# EAGLE design devBoard (EAGLE 7.2.0)
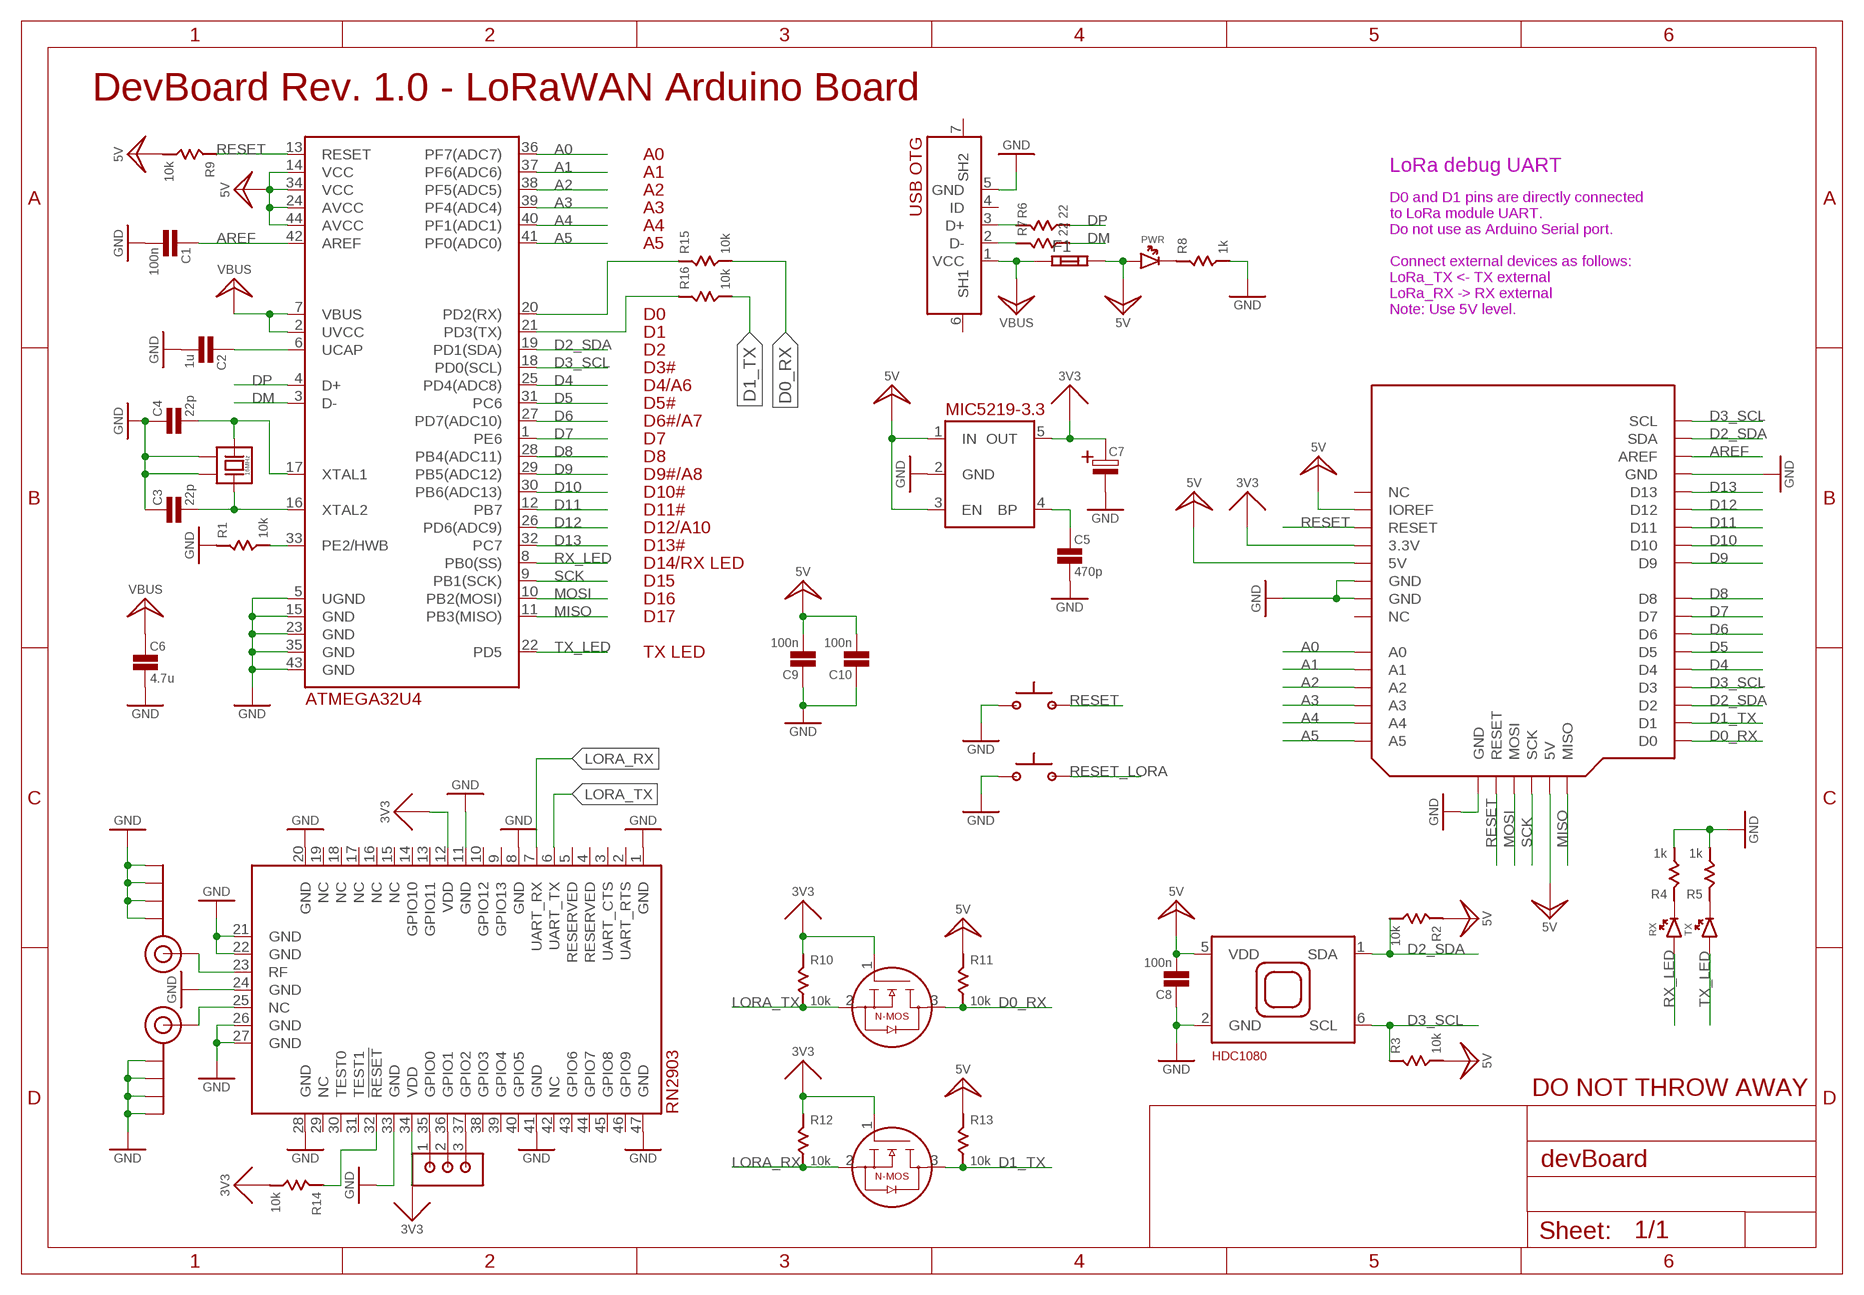
[diagram p0: schematic, sheet 1]

## Parts
C1  100n  C0603  [0603]
C2  1u  C0603  [0603]
C3  22p  C0603  [0603]
C4  22p  C0603  [0603]
C5  470p  C0603  [0603]
C6  4.7u  C0603  [0603]
C7  CT3216  [CT3216]
C8  100n  C0603  [0603]
C9  100n  C0603  [0603]
C10  100n  C0603  [0603]
F1  MF-MSMF050  [MF-MSMF050]
J$1  SMA_EDGE  [SMA-EDGE]
J$2  SMA_EDGE  [SMA-EDGE]
PWR  PWR  0603LED  [0603LED]
R1  10k  R0603  [0603]
R2  10k  R0603  [0603]
R3  10k  R0603  [0603]
R4  1k  R0603  [0603]
R5  1k  R0603  [0603]
R6  22  R0603  [0603]
R7  22  R0603  [0603]
R8  1k  R0603  [0603]
R9  10k  R0603  [0603]
R10  10k  R0603  [0603]
R11  10k  R0603  [0603]
R12  10k  R0603  [0603]
R13  10k  R0603  [0603]
R14  10k  R0603  [0603]
R15  10k  R0603  [0603]
R16  10k  R0603  [0603]
RX  RX  0603LED  [0603LED]
SW2  PUSH_BTN  [PUSH_BTN]
SW3  PUSH_BTN  [PUSH_BTN]
T1  BSS138  [SOT23-3]
T2  BSS138  [SOT23-3]
TX  TX  0603LED  [0603LED]
U1  RN2903  [RN2903]
U$1  ATMEGA32U4-MU  [QFN44]
U$2  ARDUINO_UNO  [ARDUINO_UNO]
U$9  HDC1080  [HDC1080]
U$34  MIC5219-3.3  [SOT-23-5]
U$45  USB_OTG  [USB_OTG]
U$59  1X3_HEADER  [1X3_HEADER]
U$65  DONT_THROW  [DONT_THROW]
Y1  16MHz  CX3225SB12000H0PSTC1  [XTAL3225]

## Nets
3V3: C7.AN R10.1 R12.1 R14.2 T1.1(G) T2.1(G) U1.12(VDD) U1.34(VDD) U$2.3.3V U$34.5(OUT)
5V: C8.2 C9.2 C10.2 F1.2 PWR.AN R2.1 R3.2 R9.2 R11.1 R13.1 U$1.14(VCC) U$1.24(AVCC) U$1.34(VCC) U$1.44(AVCC) U$2.5V U$2.ICSP_2(5V) U$2.IOREF U$9.5(VDD) U$34.1(IN) U$34.3(EN)
A0: U$1.36(PF7(ADC7)) U$2.A0
A1: U$1.37(PF6(ADC6)) U$2.A1
A2: U$1.38(PF5(ADC5)) U$2.A2
A3: U$1.39(PF4(ADC4)) U$2.A3
A4: U$1.40(PF1(ADC1)) U$2.A4
A5: U$1.41(PF0(ADC0)) U$2.A5
AREF: C1.1 U$1.42(AREF) U$2.AREF
D0_RX: R11.2 R15.2 T1.3(D) U$2.D0
D1_TX: R13.2 R16.2 T2.3(D) U$2.D1
D2_SDA: R2.2 U$1.19(PD1(SDA)) U$2.D2 U$2.SDA U$9.1(SDA)
D3_SCL: R3.1 U$1.18(PD0(SCL)) U$2.D3 U$2.SCL U$9.6(SCL)
D4: U$1.25(PD4(ADC8)) U$2.D4
D5: U$1.31(PC6) U$2.D5
D6: U$1.27(PD7(ADC10)) U$2.D6
D7: U$1.1(PE6) U$2.D7
D8: U$1.28(PB4(ADC11)) U$2.D8
D9: U$1.29(PB5(ADC12)) U$2.D9
D10: U$1.30(PB6(ADC13)) U$2.D10
D11: U$1.12(PB7) U$2.D11
D12: U$1.26(PD6(ADC9)) U$2.D12
D13: U$1.32(PC7) U$2.D13
DM: R7.2 U$1.3(D-)
DP: R6.2 U$1.4(D+)
GND: C1.2 C2.2 C3.1 C4.1 C5.2 C6.2 C7.CAT C8.1 C9.1 C10.1 J$1.GND@0(GND) J$1.GND@1(GND) J$1.GND@2(GND) J$1.GND@3(GND) J$2.GND@0(GND) J$2.GND@1(GND) J$2.GND@2(GND) J$2.GND@3(GND) R1.1 R4.2 R5.2 R8.2 SW2.1 SW3.1 U1.1(GND) U1.8(GND) U1.11(GND) U1.20(GND) U1.21(GND) U1.22(GND) U1.24(GND) U1.26(GND) U1.27(GND) U1.28(GND) U1.33(GND) U1.41(GND) U1.47(GND) U$1.5(UGND) U$1.15(GND) U$1.23(GND) U$1.35(GND) U$1.43(GND) U$2.GND@2(GND) U$2.GND@3(GND) U$2.GND@4(GND) U$2.ICSP_6(GND) U$9.2(GND) U$34.2(GND) U$45.5(GND) Y1.2 Y1.4
LORA_RX: R12.2 T2.2(S) U1.7(UART_RX)
LORA_TX: R10.2 T1.2(S) U1.6(UART_TX)
MISO: U$1.11(PB3(MISO)) U$2.ICSP_1(MISO)
MOSI: U$1.10(PB2(MOSI)) U$2.ICSP_4(MOSI)
N$1: R1.2 U$1.33(PE2/HWB)
N$2: C2.1 U$1.6(UCAP)
N$3: J$1.SIG(SIGNAL) U1.23(RF)
N$6: J$2.SIG(SIGNAL) U1.25(NC)
N$7: C3.2 U$1.16(XTAL2) Y1.1
N$8: C4.2 U$1.17(XTAL1) Y1.3
N$9: C5.1 U$34.4(BP)
N$10: R4.1 RX.CA
N$11: R5.1 TX.CA
N$12: R6.1 U$45.3(D+)
N$13: R7.1 U$45.2(D-)
N$14: PWR.CA R8.1
N$15: U1.37(GPIO2) U$59.3
N$16: U1.36(GPIO1) U$59.2
N$17: U1.35(GPIO0) U$59.1
N$18: R15.1 U$1.20(PD2(RX))
N$19: R16.1 U$1.21(PD3(TX))
RESET: R9.1 SW2.2 U$1.13(RESET) U$2.ICSP_5(RESET) U$2.RESET
RESET_LORA: R14.1 SW3.2 U1.32(!RESET)
RX_LED: RX.AN U$1.8(PB0(SS))
SCK: U$1.9(PB1(SCK)) U$2.ICSP_3(SCK)
TX_LED: TX.AN U$1.22(PD5)
VBUS: C6.1 F1.1 U$1.2(UVCC) U$1.7(VBUS) U$45.1(VCC)
Unconnected: U1.2(UART_RTS) U1.3(UART_CTS) U1.4(RESERVED) U1.5(RESERVED) U1.9(GPIO13) U1.10(GPIO12) U1.13(GPIO11) U1.14(GPIO10) U1.15(NC) U1.16(NC) U1.17(NC) U1.18(NC) U1.19(NC) U1.29(NC) U1.30(TEST0) U1.31(TEST1) U1.38(GPIO3) U1.39(GPIO4) U1.40(GPIO5) U1.42(NC) U1.43(GPIO6) U1.44(GPIO7) U1.45(GPIO8) U1.46(GPIO9) U$2.NC@1(NC) U$2.NC@2(NC) U$45.4(ID) U$45.6(SH1) U$45.7(SH2)

## Notes on the sheet
- DevBoard Rev. 1.0 - LoRaWAN Arduino Board
- LoRa debug UART
- D0 and D1 pins are directly connected
  to LoRa module UART.
  Do not use as Arduino Serial port.
  
  Connect external devices as follows:
  LoRa_TX <- TX external
  LoRa_RX -> RX external
  Note: Use 5V level.

## Library data of the parts
C1-C6 C8-C10 = reach:C0603
C7 = veloTrack:CT3216
F1 = reach:MF-MSMF050
J$1 J$2 = SparkFun-Connectors:SMA_EDGE: SMA Antenna Connector End launch SMA connector. The paste layer has been removed so that the connector can be hand soldered onto the board after reflow.
PWR RX TX = reach:0603LED
R1-R16 = reach:R0603
SW2 SW3 = veloTrack:PUSH_BTN
T1 T2 = reach:BSS138
U1 = veloTrack:RN2903
U$1 = veloTrack:ATMEGA32U4-MU
U$2 = homenode:ARDUINO_UNO
U$9 = homenode:HDC1080
U$34 = veloTrack:MIC5219-3.3
U$45 = reach:USB_OTG
U$59 = homenode:1X3_HEADER
U$65 = veloTrack:DONT_THROW
Y1 = homenode:CX3225SB12000H0PSTC1

## Board
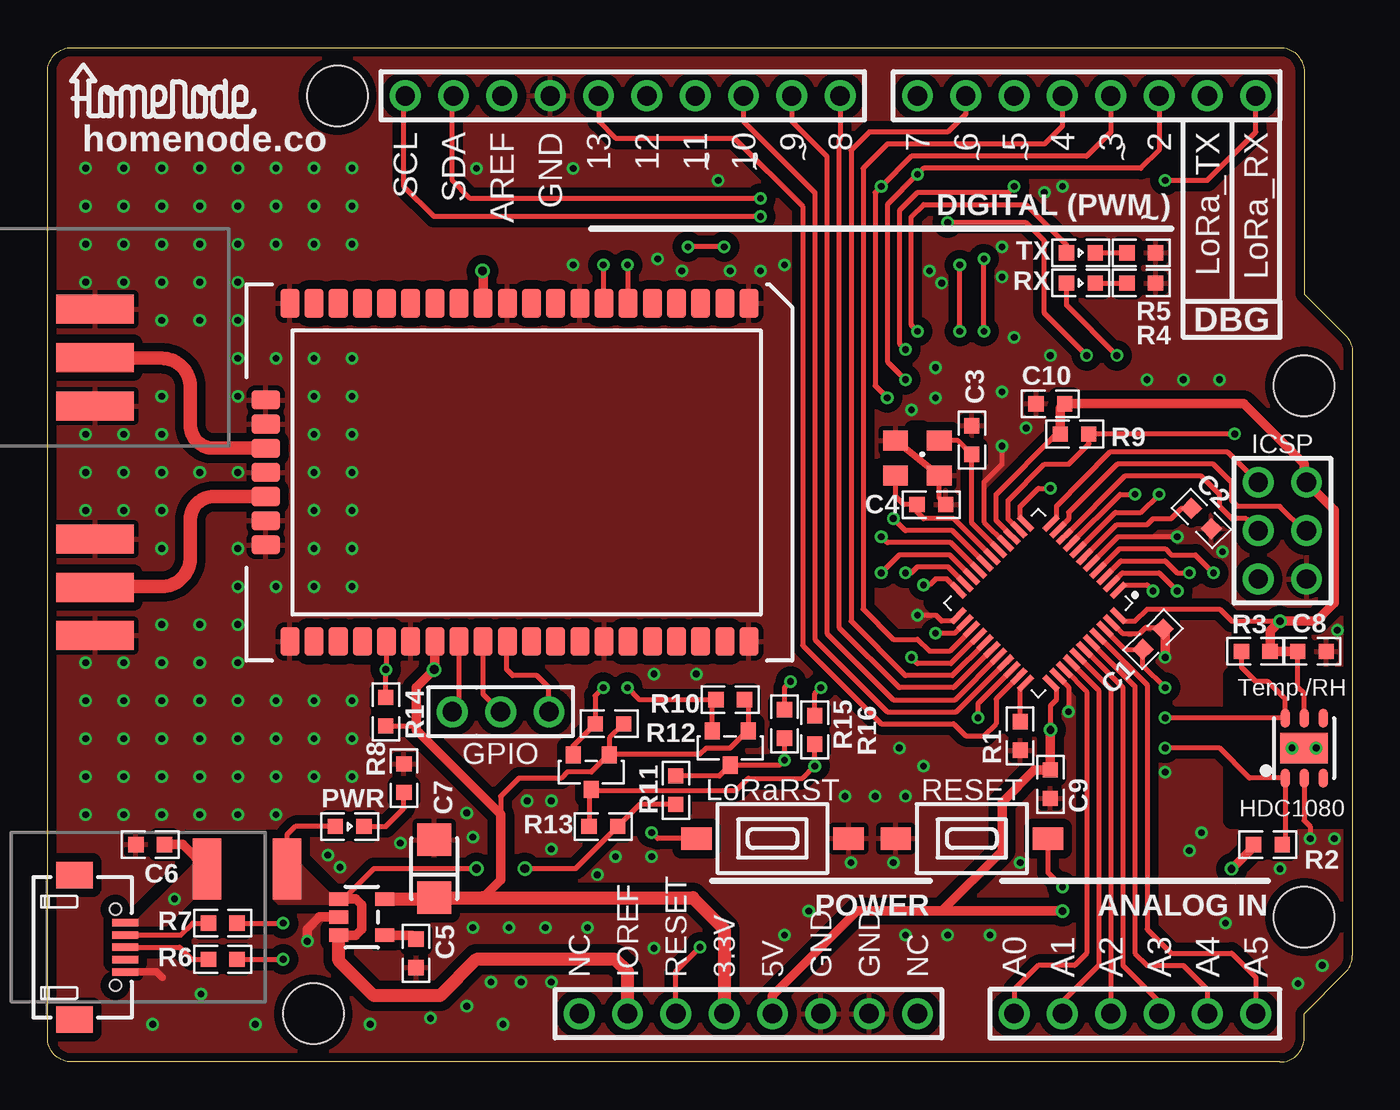
[diagram p1: board, top side]
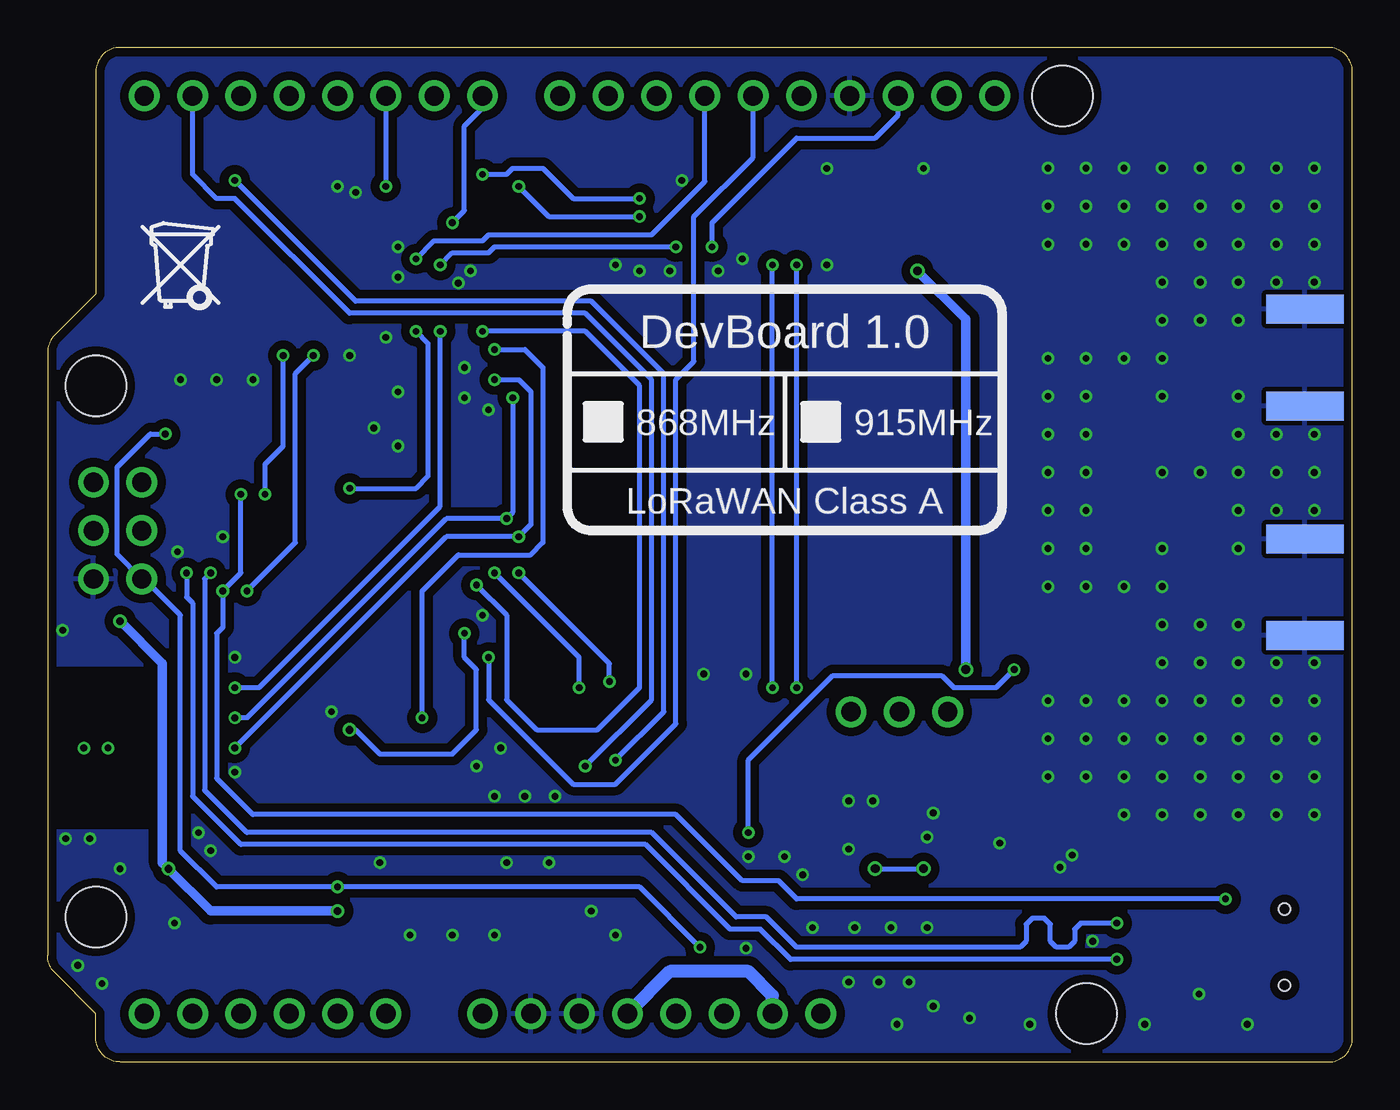
[diagram p2: board, bottom side, seen from below]

Size 68.58 x 53.34 mm. Coordinates in mm from the lower left corner, seen from the top.
Copper layers (1*16): Top 0.035mm / dielectric 1.5mm / Bottom 0.035mm
Design rules "SeeedStudio_2layer_DRU_no_angle_20140221 *": minimum track width 6mil, minimum drill 12mil, track to track 6mil, track to pad 6mil, pad to pad 6mil, via to via 6mil, smd to smd 0mil, copper to edge 10mil, drill to drill 10mil, minimum pad ring 12mil, minimum via ring 6mil, stop-mask expansion 2mil, vias tented up to drill 100mil, thermal gap 10mil
tRestrict: area 58.4,22.9 to 59.1,23.2

### Footprints (pad centres in the part's own frame; a part is rotated, then mirrored left to right if it is on the bottom)
0603 = smd 0.8 x 0.8: 1 -0.75,0; 2 0.75,0
CT3216 = smd 1.7 x 1.8: AN -1.525,0; CAT 1.525,0
MF-MSMF050 = smd 1.5 x 3.2: 1 -2.1,0; 2 2.1,0
SMA-EDGE = smd 1.524 x 4.064: GND@0 0,0; GND@1 5.08,0; SIG 2.54,0 | smd 1.524 x 4.064 bottom: GND@2 0,0; GND@3 5.08,0
0603LED = smd 0.8 x 0.8: AN -0.75,0; CA 0.75,0
PUSH_BTN = smd 1.6 x 1.2: 1 -4,0; 2 4,0
SOT23-3 = smd 0.8 x 0.9: 1 -0.95,-0.9; 2 0.95,-0.9; 3 0,0.9
RN2903 = smd 1.524 x 1.016: 1 8.89,-12.065; 2 8.89,-10.795; 3 8.89,-9.525; 4 8.89,-8.255; 5 8.89,-6.985; 6 8.89,-5.715; 7 8.89,-4.445; 8 8.89,-3.175; 9 8.89,-1.905; 10 8.89,-0.635; 11 8.89,0.635; 12 8.89,1.905; 13 8.89,3.175; 14 8.89,4.445; 15 8.89,5.715; 16 8.89,6.985; 17 8.89,8.255; 18 8.89,9.525; 19 8.89,10.795; 20 8.89,12.065; 28 -8.89,12.065; 29 -8.89,10.795; 30 -8.89,9.525; 31 -8.89,8.255; 32 -8.89,6.985; 33 -8.89,5.715; 34 -8.89,4.445; 35 -8.89,3.175; 36 -8.89,1.905; 37 -8.89,0.635; 38 -8.89,-0.635; 39 -8.89,-1.905; 40 -8.89,-3.175; 41 -8.89,-4.445; 42 -8.89,-5.715; 43 -8.89,-6.985; 44 -8.89,-8.255; 45 -8.89,-9.525; 46 -8.89,-10.795; 47 -8.89,-12.065 | smd 1.016 x 1.524: 21 3.81,13.335; 22 2.54,13.335; 23 1.27,13.335; 24 0,13.335; 25 -1.27,13.335; 26 -2.54,13.335; 27 -3.81,13.335
QFN44 = smd 1 x 0.3: 1 -3.45,2.5; 2 -3.45,2; 3 -3.45,1.5; 4 -3.45,1; 5 -3.45,0.5; 6 -3.45,0; 7 -3.45,-0.5; 8 -3.45,-1; 9 -3.45,-1.5; 10 -3.45,-2; 11 -3.45,-2.5; 23 3.45,-2.5; 24 3.45,-2; 25 3.45,-1.5; 26 3.45,-1; 27 3.45,-0.5; 28 3.45,0; 29 3.45,0.5; 30 3.45,1; 31 3.45,1.5; 32 3.45,2; 33 3.45,2.5 | smd 0.3 x 1: 12 -2.5,-3.45; 13 -2,-3.45; 14 -1.5,-3.45; 15 -1,-3.45; 16 -0.5,-3.45; 17 0,-3.45; 18 0.5,-3.45; 19 1,-3.45; 20 1.5,-3.45; 21 2,-3.45; 22 2.5,-3.45; 34 2.5,3.45; 35 2,3.45; 36 1.5,3.45; 37 1,3.45; 38 0.5,3.45; 39 0,3.45; 40 -0.5,3.45; 41 -1,3.45; 42 -1.5,3.45; 43 -2,3.45; 44 -2.5,3.45
ARDUINO_UNO = drill 1.016: 3.3V 35.56,2.54; 5V 38.1,2.54; A0 50.8,2.54; A1 53.34,2.54; A2 55.88,2.54; A3 58.42,2.54; A4 60.96,2.54; A5 63.5,2.54; AREF 23.876,50.8; D0 63.5,50.8; D1 60.96,50.8; D2 58.42,50.8; D3 55.88,50.8; D4 53.34,50.8; D5 50.8,50.8; D6 48.26,50.8; D7 45.72,50.8; D8 41.656,50.8; D9 39.116,50.8; D10 36.576,50.8; D11 34.036,50.8; D12 31.496,50.8; D13 28.956,50.8; GND@2 26.416,50.8; GND@3 43.18,2.54; GND@4 40.64,2.54; ICSP_1 63.627,30.48; ICSP_2 66.167,30.48; ICSP_3 63.627,27.94; ICSP_4 66.167,27.94; ICSP_5 63.627,25.4; ICSP_6 66.167,25.4; IOREF 30.48,2.54; NC@1 45.72,2.54; NC@2 27.94,2.54; RESET 33.02,2.54; SCL 18.796,50.8; SDA 21.336,50.8 | hole 3.175: 13.97,2.54; 66.04,35.56; 66.04,7.62; 15.24,50.8
HDC1080 = smd 0.5 x 1: 1 -1,-1.575; 2 0,-1.575; 3 1,-1.575; 4 1,1.575; 5 0,1.575; 6 -1,1.575 | smd 2.5 x 1.6: 7 0,0
SOT-23-5 = smd 0.7 x 1: 1 0.95,1.2; 2 0,1.2; 3 -0.95,1.2; 4 -0.95,-1.2; 5 0.95,-1.2
USB_OTG = smd 0.4 x 1.35: 1 -1.3,-0.675; 2 -0.65,-0.675; 3 0,-0.675; 4 0.65,-0.675; 5 1.3,-0.675 | smd 1.4 x 1.9: 6 -3.8,-3.35; 7 3.8,-3.35 | hole 0.6: -2,-1.2; 2,-1.2
1X3_HEADER = drill 1.016: 1 -2.54,0; 2 0,0; 3 2.54,0
XTAL3225 = smd 1.3 x 1.05: 1 -1.15,-0.925; 2 1.15,-0.925; 3 1.15,0.925; 4 -1.15,0.925

### Placement (x,y rotation side)
C1  58.1,22.23 45 top
C2  60.64,28.57 315 top
C3  48.58,32.7 270 top
C4  46.45,29.3 180 top
C5  19.37,5.71 270 top
C6  5.4,11.43 180 top
C7  20.32,10.16 90 top
C8  66.45,21.59 180 top
C9  52.7,14.61 90 top
C10  52.7,34.61 0 top
F1  10.48,10.16 0 top
J$1  2.5,34.5 90 top
J$2  2.5,27.5 270 top
PWR  15.88,12.38 0 top
R1  51.12,17.14 90 top
R2  64.14,11.43 0 top
R3  63.5,21.59 0 top
R4  57.48,40.96 0 top
R5  57.48,42.55 0 top
R6  9.21,5.4 0 top
R7  9.21,7.3 0 top
R8  18.73,14.92 90 top
R9  53.98,33.02 180 top
R10  35.88,19.05 180 top
R11  33.02,14.29 90 top
R12  29.53,17.78 180 top
R13  29.21,12.38 180 top
R14  17.78,18.41 270 top
R15  38.73,17.78 270 top
R16  40.32,17.46 270 top
RX  54.31,40.96 0 top
SW2  48.58,11.75 0 top
SW3  38.1,11.75 180 top
T1  35.88,16.51 180 top
T2  28.57,15.24 180 top
TX  54.31,42.55 0 top
U1  24.8,31 90 top
U$1  52.07,24.13 225 top
U$2  0,0 0 top
U$9  66.04,16.51 0 top
U$34  16.51,7.62 90 top
U$45  4.76,6.03 270 top
U$59  23.81,18.41 0 top
U$62  [HOMENODE]  6.35,50.48 0 top
U$63  [BACK_LABEL]  29.84,34.29 0 bottom
U$65  61.59,41.91 0 bottom
Y1  45.72,31.75 180 top

### Tracks (layer width: path | path; a pad name or v marks a point on that pad's centre or on a via)
3V3  (via drill 0.46)
  Top 0.254: T2.1 29.48,16.14 28.57,15.24 27.3,15.24 26.99,14.92 24.77,14.92 23.81,13.97 23.81,13.02 | T2.1 29.58,16.19 34.29,16.19 34.61,16.51 35.88,16.51 36.78,17.41 T1.1 36.83,18.85 R10.1 | R12.1 29.52,17.03 T2.1 | R14.2 19.16,17.66 19.53,17.3
  Top 0.508: 22.86,8.63 23.81,9.59 23.81,13.02 19.53,17.3 19.37,17.46 19.37,19.68 v20.32,20.64 20.36,20.67 U1.34 | U1.12 22.89,41.56 v22.86,41.59
  Top 0.686: U$34.5 20.25,8.57 C7.AN 22.86,8.63 33.91,8.63 35.56,6.99 U$2.3.3V
  Bottom 0.508: v22.86,41.59 20.32,39.05 v20.32,20.64
5V  (via drill 0.36, 0.41, 0.46)
  Top 0.254: PWR.AN 13.02,12.38 12.58,11.94 F1.2 | U$9.5 66.04,19.37 65.7,19.7 C8.2 | U$1.14 49.85,28.47 49.85,29.84 53.02,33.02 R9.2 | R11.1 31.11,13.54 R13.1 27.74,10.16 v25.08,10.16 | v22.54,10.16 17.14,10.16 15.55,8.57 U$34.1 | U$1.34 53.02,19.64 53.02,19.05 52.7,18.73 v52.7,17.46 | U$1.44 56.56,23.18 57.15,23.18 57.78,23.81 61.59,23.81 62.23,23.18 v64.77,23.18 | U$1.24 47.65,22.54 v46.67,22.54
  Top 0.508: U$34.1 16.2,8.57 16.51,8.26 16.51,6.99 16.2,6.67 U$34.3 | U$2.5V 38.1,3.49 42.55,7.94 46.99,7.94 | v52.7,17.46 C9.2 51.87,15.36 50.16,13.65 50.16,11.11 46.99,7.94 | 46.99,7.94 v53.34,7.94 | v62.23,10.16 63.38,11.31 R2.1 | C8.2 R3.2 64.25,22.66 v64.77,23.18 66.67,23.18 67.63,24.13 67.63,29.02 U$2.ICSP_2 66.04,30.61 66.04,31.43 62.87,34.61 C10.2 53.23,34.38 R9.2
  Top 0.686: U$2.IOREF 30.48,4.76 29.84,5.4 22.54,5.4 20.64,3.49 17.14,3.49 15.31,5.33 U$34.3
  Bottom 0.254: v25.08,10.16 v22.54,10.16 | v52.7,17.46 52.39,17.46 51.12,16.19 47.31,16.19 46.04,17.46 46.04,20.64 46.67,21.27 v46.67,22.54
  Bottom 0.508: v53.34,7.94 60.01,7.94 v62.23,10.16 62.55,10.48 62.55,20.95 v64.77,23.18
  Bottom 0.686: U$2.IOREF 30.48,3.49 31.75,4.76 35.88,4.76 U$2.5V
  pour Top (no thermals): 15.77,8.26 12.15,8.26 11.85,8.56 11.85,11.72 13.3,11.72 13.3,10.43 14.83,8.89 15.77,8.89
A0
  Top 0.254: U$1.36 54.61,19.47 54.61,5.71 53.98,5.08 52.07,5.08 50.8,3.81 U$2.A0
A1
  Top 0.254: U$1.37 55.24,19.54 55.24,5.08 53.34,3.17 U$2.A1
A2
  Top 0.254: U$1.38 55.88,19.61 U$2.A2
A3
  Top 0.254: U$1.39 56.52,19.68 56.52,5.08 58.42,3.17 U$2.A3
A4
  Top 0.254: U$1.40 57.15,19.76 57.15,5.71 57.78,5.08 59.69,5.08 60.96,3.81 U$2.A4
A5
  Top 0.254: U$1.41 57.78,19.83 57.78,6.99 59.05,5.71 62.23,5.71 63.5,4.45 U$2.A5
AREF  (via drill 0.36)
  Top 0.254: U$1.42 56.63,21.7 C1.1 57.57,20.85 v58.74,19.68 | v47.94,38.42 v47.94,41.91 | v35.56,42.86 v33.66,42.86
  Bottom 0.254: v58.74,19.68 57.47,19.68 47.94,29.21 v47.94,38.42 | v47.94,41.91 47.31,42.55 45.4,42.55 45.09,42.86 v35.56,42.86 | v33.66,42.86 33.66,44.13 29.21,48.58 25.08,48.58 23.88,49.78 U$2.AREF
D0_RX  (via drill 0.36)
  Top 0.254: R11.2 35.3,15.04 T1.3 38.47,15.61 v38.73,15.88 R15.2 | v58.74,46.35 60.96,46.35 63.5,48.9 U$2.D0
  Bottom 0.254: v38.73,15.88 36.2,18.41 36.2,36.2 40.01,40.01 52.39,40.01 v58.74,46.35
D1_TX  (via drill 0.36)
  Top 0.254: T2.3 28.63,14.29 | 28.63,14.29 36.2,14.29 36.83,14.92 39.69,14.92 v40.32,15.56 R16.2 | 28.63,14.29 28.46,14.12 R13.2
  Bottom 0.254: v40.32,15.56 36.83,19.05 36.83,35.88 40.32,39.37 52.7,39.37 58.74,45.4 59.69,45.4 60.96,46.67 U$2.D1
D2_SDA  (via drill 0.36)
  Top 0.254: v58.74,16.51 61.59,16.51 63.17,14.94 U$9.1 65.04,11.59 R2.2 | U$1.19 47.48,27.3 44.13,27.3 v43.81,27.62 | U$2.D2 58.42,47.94 57.47,46.99 46.04,46.99 v45.72,46.67 44.13,45.09 44.13,36.83 v45.09,35.88 | v37.47,45.4 22.23,45.4 21.27,46.35 21.27,50.74 U$2.SDA
  Bottom 0.254: v45.09,35.88 43.81,35.88 43.18,35.24 43.18,28.26 v43.81,27.62 47.62,27.62 v58.74,16.51 | v45.72,46.67 44.45,46.67 44.13,46.99 42.55,46.99 40.96,45.4 v37.47,45.4
D3_SCL  (via drill 0.36)
  Top 0.254: U$1.18 47.55,27.94 45.09,27.94 v44.45,28.57 | U$2.D3 55.88,48.9 54.61,47.62 45.4,47.62 v43.81,46.04 43.5,45.72 43.5,35.56 v44.13,34.92 | v37.47,44.45 20.32,44.45 18.73,46.04 18.73,50.74 U$2.SCL | v58.74,18.1 58.75,18.09 U$9.6 65.04,19.1 64.14,20 63.5,20 62.75,20.75 R3.1
  Bottom 0.254: v44.13,34.92 44.13,28.89 v44.45,28.57 47.62,28.57 58.1,18.1 v58.74,18.1 | v43.81,46.04 42.23,44.45 v37.47,44.45
D4
  Top 0.254: U$1.25 47.41,21.59 46.35,21.59 45.72,22.23 44.45,22.23 42.86,23.81 42.86,46.99 44.13,48.26 52.39,48.26 53.34,49.21 U$2.D4
D5  (via drill 0.36)
  Top 0.254: U$1.31 48.9,18.83 v48.9,18.1 | v45.09,37.47 44.77,37.78 44.77,44.77 45.72,45.72 50.48,45.72 v50.8,46.04
  Bottom 0.254: v48.9,18.1 48.9,24.77 46.99,26.67 43.18,26.67 42.55,27.3 42.55,36.51 43.5,37.47 v45.09,37.47 | U$2.D5 v50.8,46.04
D6
  Top 0.254: U$1.27 47.55,20.32 45.09,20.32 42.23,23.18 42.23,47.94 43.18,48.9 47.31,48.9 48.26,49.85 U$2.D6
D7  (via drill 0.36)
  Top 0.254: U$1.1 56.56,25.08 57.78,25.08 v58.1,24.77 | v54.61,37.15 52.39,39.37 52.39,43.18 51.44,44.13 v47.31,44.13
  Bottom 0.254: v58.1,24.77 55.56,27.3 55.56,36.2 v54.61,37.15 | v47.31,44.13 46.67,44.77 46.67,49.21 45.72,50.16 U$2.D7
D8
  Top 0.254: U$1.28 47.62,19.68 44.77,19.68 41.59,22.86 41.59,48.45 41.66,48.51 U$2.D8
D9
  Top 0.254: U$2.D9 39.12,49.47 40.96,47.62 40.96,22.54 44.45,19.05 47.7,19.05 U$1.29
D10
  Top 0.254: U$2.D10 36.58,49.47 40.32,45.72 40.32,22.23 44.13,18.41 47.77,18.41 U$1.30
D11  (via drill 0.36)
  Top 0.254: U$1.12 51.12,28.62 51.12,29.21 52.07,30.16 v52.7,30.16 | v49.21,38.42 v49.21,42.23
  Bottom 0.254: v52.7,30.16 49.21,30.16 48.58,30.8 48.58,37.78 v49.21,38.42 | v49.21,42.23 48.26,43.18 45.72,43.18 45.4,43.5 36.83,43.5 34.04,46.29 U$2.D11
D12  (via drill 0.36)
  Top 0.254: U$1.26 47.48,20.95 45.72,20.95 v45.4,21.27
  Bottom 0.254: v45.4,21.27 45.4,19.05 40.96,14.61 38.73,14.61 35.56,17.78 35.56,35.88 34.61,36.83 34.61,44.45 31.5,47.56 U$2.D12
D13
  Top 0.254: U$1.32 49.85,19.08 49.85,17.78 49.21,17.14 48.26,17.14 47.62,17.78 43.81,17.78 39.69,21.91 39.69,44.99 36.1,48.58 29.84,48.58 28.96,49.47 U$2.D13
DM  (via drill 0.36)
  Top 0.254: U$1.3 56.41,26.35 58.74,26.35 59.37,25.72 v60.01,25.72 | R7.2 v12.38,7.3
  Bottom 0.254: v12.38,7.3 14.29,7.3 14.61,6.99 14.61,6.35 14.92,6.03 15.56,6.03 15.88,6.35 15.88,7.24 16.19,7.56 16.83,7.56 17.14,7.24 17.14,6.35 17.46,6.03 29.21,6.03 30.8,7.62 32.38,7.62 36.83,12.06 58.1,12.06 60.33,14.29 60.33,25.4 v60.01,25.72
DP  (via drill 0.36)
  Top 0.254: U$1.4 56.34,26.99 58.74,26.99 59.05,26.67 60.33,26.67 v61.28,25.72 | R6.2 v12.38,5.4
  Bottom 0.254: v12.38,5.4 29.53,5.4 31.11,6.99 32.7,6.99 37.15,11.43 58.42,11.43 60.96,13.97 60.96,24.13 61.28,24.45 v61.28,25.72
GND  (via drill 0.36)
  Top 0.254: U$1.23 47.58,23.18 46.99,23.18 46.67,23.5 v45.72,23.5 | C4.1 46.87,29.64 Y1.4 | U$1.15 49.21,28.4 49.21,30.48 50.16,31.43 v50.16,32.38 | U$1.5 56.27,27.62 v59.37,27.62 | U$1.35 53.66,19.71 v53.66,18.41 | U$9.2 66.04,12.7 66.36,12.38 v66.36,11.75 | U$1.43 56.49,22.54 57.4,22.54 57.72,22.86 58.53,22.86 C1.2
  Top 0.399: U$45.5 5.75,4.73 6.03,4.45
  Top 0.4: Y1.4 Y1.2
  Top 0.508: v13.65,6.35 13.65,6.99 14.29,7.62 15.24,7.62 | C1.2 58.74,22.65 v58.74,21.27
  other vias: 27.62,41.91 10,31 8,31 6,31 4,31 2,31 2,29 4,29 6,29 6,27 6,33 6,35 4,33 2,33 10,35 10,37 10,39 8,39 6,39 6,41 8,41 10,41 14,35 14,33 14,31 14,29 14,27 14,25 12,25 10,25 10,27 10,23 8,23 6,23 6,21 8,21 10,21 14,37 12,37 2,43 4,43 6,43 8,43 10,43 12,43 14,43 12,19 14,19 16,25 16,27 16,29 16,31 16,33 16,35 16,37 16,43 16,19 10,19 8,19 6,19 4,19 2,19 2,17 4,17 6,17 8,17 10,17 12,17 14,17 16,17 16,45 14,45 12,45 10,45 8,45 6,45 4,45 2,45 2,47 4,41 2,41 4,21 2,21 4,47 6,47 8,47 10,47 12,47 14,47 16,47 2,15 4,15 6,15 8,15 10,15 12,15 14,15 16,15 16.95,1.98 23.94,1.98 10.92,1.98 5.52,1.98 8.06,3.57 67.63,11.75 61.75,26.83 14.73,10.87 45.4,34.29 2,13 4,13 6,13 8,13 10,13 12,13 26.48,13.73 31.88,20.4 34.1,20.4 22.35,7.06 31.88,5.98 67.79,22.7 51.12,10.48 44.77,16.51 60.01,11.11 46.04,15.56 40.01,7.94 38.73,6.67 44.45,10.48 42.23,10.48 60.64,12.06 45.09,13.97 26.48,11.19 22.35,11.82 64.77,10.16 65.72,4.13 66.99,5.08 46.67,36.51 50.8,38.1 52.7,37.15 50.16,35.24 57.78,35.88 59.69,35.88 61.59,35.88 52.39,45.72 50.16,42.86 41.91,13.97 43.5,13.97 58.74,15.24 45.09,6.67 47.31,6.67 49.53,6.67 23.3,4.21 24.89,4.21 26.48,4.21 22.03,2.94 20.13,2.3 28.89,9.84 29.84,10.79 31.75,10.79 38.73,41.91 27.62,46.99 35.24,46.35 33.34,41.59 35.88,41.59 46.67,34.92 50.16,41.27 46.35,41.59 51.44,33.34 32.07,42.23 37.47,41.59 15.37,10.24 18.54,11.51 22.03,13.1 25.21,13.73 61.91,7.3 24.25,7.06 26.16,7.06 28.38,7.06 53.34,46.04 46.99,40.96 22.54,46.99
  pour Top (isolate 0.457, rank 2): -2.54,55.88 71.12,55.88 71.12,-2.54 -2.54,-2.54 -2.54,50.8
  pour Bottom (isolate 0.457): -5.08,58.42 73.66,58.42 73.66,-5.08 -5.08,-5.08
LORA_RX  (via drill 0.36)
  Top 0.254: v29.21,19.68 28.78,19.25 R12.2 27.62,16.63 T2.2 | v29.21,41.91 29.21,39.92 U1.7
  Bottom 0.254: v29.21,19.68 v29.21,41.91
LORA_TX  (via drill 0.36)
  Top 0.254: T1.2 34.93,18.85 R10.2 31.11,19.05 v30.48,19.68 | v30.48,41.91 30.48,39.92 U1.6
  Bottom 0.254: v30.48,19.68 v30.48,41.91
MISO
  Top 0.254: U$2.ICSP_1 62.04,32.07 55.84,32.07 53.02,29.21 53.02,28.62 U$1.11
MOSI
  Top 0.254: U$2.ICSP_4 66.04,27.94 64.77,29.21 62.55,29.21 62.23,29.53 62.23,30.48 61.28,31.43 56.23,31.43 53.66,28.89 53.66,28.55 U$1.10
N$1
  Top 0.254: R1.2 51.12,19.64 U$1.33
N$2
  Top 0.254: U$1.6 56.2,28.26 57.78,28.26 58.1,28.57 59.05,28.57 59.59,29.11 C2.1
N$3
  Top 0.7: U1.23 8.73,32.27 arc-90 7.5,33.5 7.5,35.5 arc90 6,37 2.5,37 J$1.SIG
N$4  (via drill 0.36)
  other vias: 65.41,16.51
N$5  (via drill 0.36)
  other vias: 66.67,16.51
N$6
  Top 0.7: U1.25 8.73,29.73 arc90 7.5,28.5 7.5,26.5 arc-90 6,25 2.5,25 J$2.SIG
N$7
  Top 0.254: U$1.16 48.58,28.33 C3.2 47.85,32.67 Y1.1
N$8
  Top 0.254: U$1.17 47.62,28.57 46.04,28.57 45.7,28.91 C4.2 44.99,29.3 44.57,29.73 Y1.3
N$9
  Top 0.508: U$34.4 19.16,6.67 C5.1
N$10
  Top 0.254: RX.CA R4.1
N$11
  Top 0.254: TX.CA R5.1
N$12
  Top 0.254: U$45.3 6.95,6.03 7.58,5.4 R6.1
N$13
  Top 0.254: U$45.2 7,6.68 7.62,7.3 R7.1
N$14
  Top 0.254: PWR.CA 17.78,12.38 18.73,13.34 R8.1
N$15
  Top 0.254: U$59.3 26.35,19.68 25.72,20.32 24.45,20.32 24.13,20.64 24.13,22.07 U1.37
N$16
  Top 0.254: U$59.2 22.89,19.33 U1.36
N$17
  Top 0.254: U$59.1 21.62,18.77 U1.35
N$18  (via drill 0.36)
  Top 0.254: R15.1 38.73,19.68 v39.05,20 | U$1.20 47.41,26.67 44.77,26.67 v43.81,25.72
  Bottom 0.254: v39.05,20 39.05,20.95 v43.81,25.72
N$19  (via drill 0.36)
  Top 0.254: R16.1 40.32,19.37 v40.64,19.68 | U$1.21 47.34,26.04 45.72,26.04 45.4,25.72 v45.09,25.72
  Bottom 0.254: v40.64,19.68 40.64,21.27 v45.09,25.72
RESET  (via drill 0.36)
  Top 0.254: U$2.RESET 33.02,4.76 v34.29,6.03 | U$1.13 50.48,28.55 50.48,29.53 52.39,31.43 53.66,31.43 54.73,32.5 R9.1 v62.39,33.02 | SW2.2 52.58,9.97 v53.34,9.21
  Bottom 0.254: v62.39,33.02 63.18,33.02 64.93,31.27 64.93,26.7 U$2.ICSP_5 63.5,25.4 61.59,23.5 61.59,11.11 59.69,9.21 v53.34,9.21 37.47,9.21 v34.29,6.03
RESET_LORA  (via drill 0.36)
  Top 0.254: R14.1 v17.78,20.64 17.82,20.67 U1.32 | SW3.2 32.07,11.75 v31.75,12.06
  Bottom 0.254: v31.75,12.06 31.75,15.88 27.3,20.32 21.59,20.32 20.95,19.68 18.73,19.68 v17.78,20.64
RX_LED  (via drill 0.36)
  Top 0.254: U$1.8 56.37,29.84 v57.15,29.84 | v56.2,37.15 53.56,39.79 RX.AN
  Bottom 0.254: v57.15,29.84 57.15,31.43 56.2,32.38 v56.2,37.15
SCK
  Top 0.254: U$2.ICSP_3 62.99,28.57 62.23,28.57 61.59,29.21 61.59,29.84 60.64,30.8 56.62,30.8 U$1.9
TX_LED  (via drill 0.36)
  Top 0.254: U$1.22 47.26,25.4 46.67,25.4 46.35,25.08 v46.04,25.08 | v45.72,38.42 45.4,38.73 45.4,44.45 46.04,45.09 51.44,45.09 53.56,42.96 TX.AN
  Bottom 0.254: v46.04,25.08 44.45,23.5 44.45,19.05 42.86,17.46 39.69,17.46 37.47,19.68 37.47,35.56 40.32,38.42 v45.72,38.42
VBUS  (via drill 0.36)
  Top 0.254: U$1.7 56.12,28.89 57.47,28.89 v58.42,29.84 | U$1.2 56.49,25.72 58.42,25.72 v59.37,24.77
  Top 0.508: C6.1 7.11,11.43 F1.1
  Bottom 0.254: v6.67,8.57 29.21,8.57 30.16,9.53 32.07,9.53 35.56,13.02 57.78,13.02 59.69,14.92 59.69,22.54 59.37,22.86 v59.37,24.77 58.42,25.72 v58.42,29.84
  pour Top (no thermals): 3.45,7.49 3.45,7.16 6.26,7.16 7.65,8.55 9.11,8.55 9.11,11.72 7.66,11.72 7.66,10.41 4.74,7.49

### Text on the board
tPlace: homenode.co | DBG | Temp./RH | GPIO | LoRaRST | RESET | HDC1080